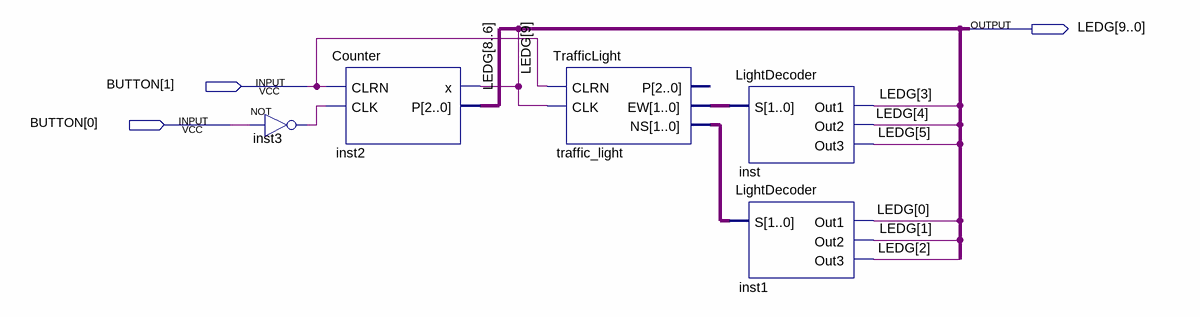
[diagram p0: schematic sheet]
// Quartus schematic Lab_6a.bdf as structural Verilog: 5 symbols, 3 pins
module Lab_6a (
  input  [1:0] BUTTON,
  output [9:0] LEDG
);

  wire inst3_out;
  wire [1:0] traffic_light_ew, traffic_light_ns;

  not inst3 (inst3_out, BUTTON[0]);
  Counter inst2 (.CLRN(BUTTON[1]), .CLK(inst3_out), .x(LEDG[9]), .P(LEDG[8:6]));
  TrafficLight traffic_light (
    .CLRN(BUTTON[1]), .CLK(LEDG[9]), .EW(traffic_light_ew), .NS(traffic_light_ns));  // open: P
  LightDecoder inst (.S(traffic_light_ew), .Out1(LEDG[3]), .Out2(LEDG[4]), .Out3(LEDG[5]));
  LightDecoder inst1 (.S(traffic_light_ns), .Out1(LEDG[0]), .Out2(LEDG[1]), .Out3(LEDG[2]));
endmodule
